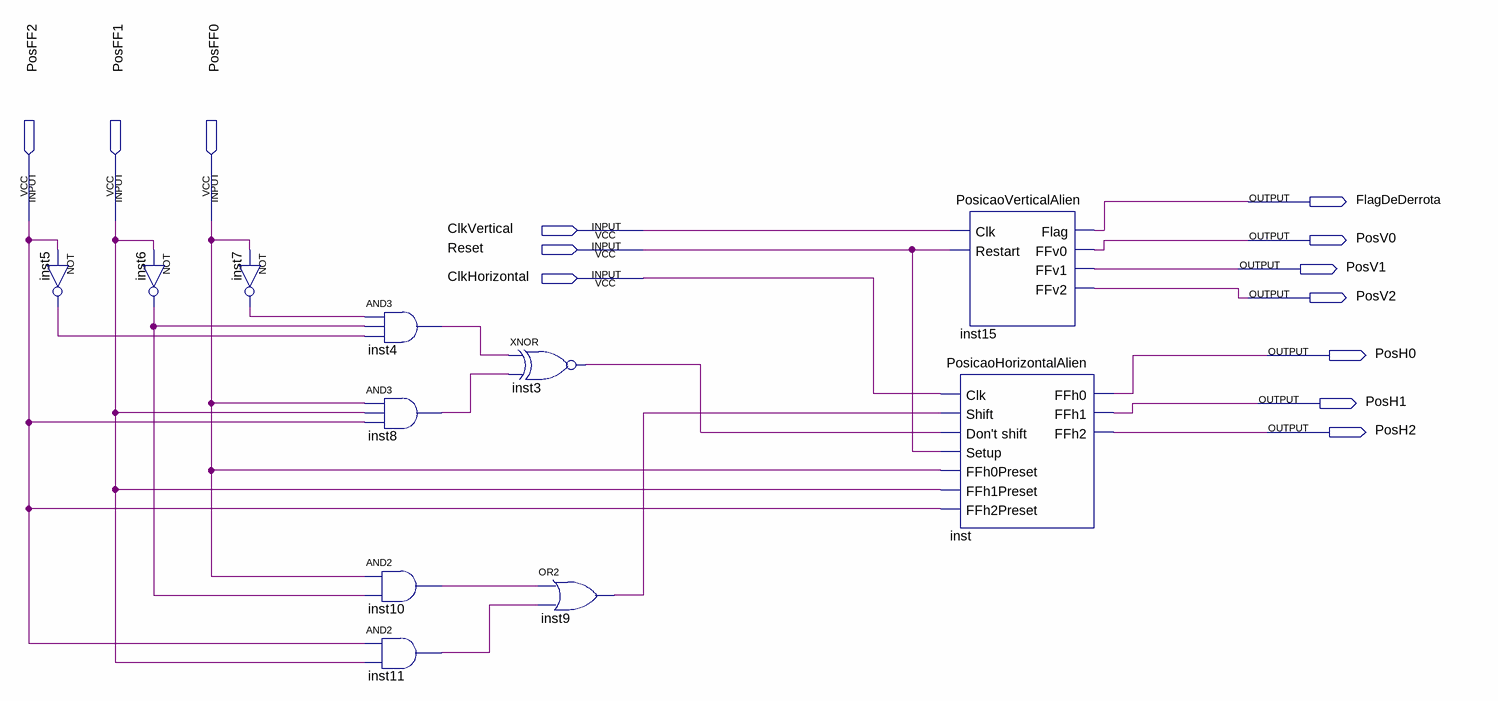
[diagram p0: schematic sheet]
// Quartus schematic PosicaoAlien.bdf as structural Verilog: 11 symbols, 13 pins
module PosicaoAlien (
  input  PosFF2,
  input  PosFF1,
  input  PosFF0,
  input  ClkVertical,
  input  Reset,
  input  ClkHorizontal,
  output FlagDeDerrota,
  output PosV0,
  output PosV1,
  output PosV2,
  output PosH0,
  output PosH1,
  output PosH2
);

  wire inst3_out, inst4_out, inst5_out, inst6_out, inst7_out, inst8_out, inst9_out, inst10_out, inst11_out;

  not inst5 (inst5_out, PosFF2);
  not inst6 (inst6_out, PosFF1);
  not inst7 (inst7_out, PosFF0);
  and inst4 (inst4_out, inst7_out, inst6_out, inst5_out);
  and inst8 (inst8_out, PosFF0, PosFF1, PosFF2);
  and inst10 (inst10_out, PosFF0, inst6_out);
  and inst11 (inst11_out, PosFF2, PosFF1);
  xnor inst3 (inst3_out, inst4_out, inst8_out);
  or inst9 (inst9_out, inst10_out, inst11_out);
  PosicaoVerticalAlien inst15 (
    .Clk(ClkVertical), .Restart(Reset), .Flag(FlagDeDerrota), .FFv0(PosV0), .FFv1(PosV1), .FFv2(PosV2));
  PosicaoHorizontalAlien inst (
    .Clk(ClkHorizontal), .Shift(inst9_out), .\Don't_shift (inst3_out), .Setup(Reset), .FFh0Preset(PosFF0),
    .FFh1Preset(PosFF1), .FFh2Preset(PosFF2), .FFh0(PosH0), .FFh1(PosH1), .FFh2(PosH2));
endmodule
